# Altium schematic sheet Flasher_2Ch_Astable.SchDoc
size A
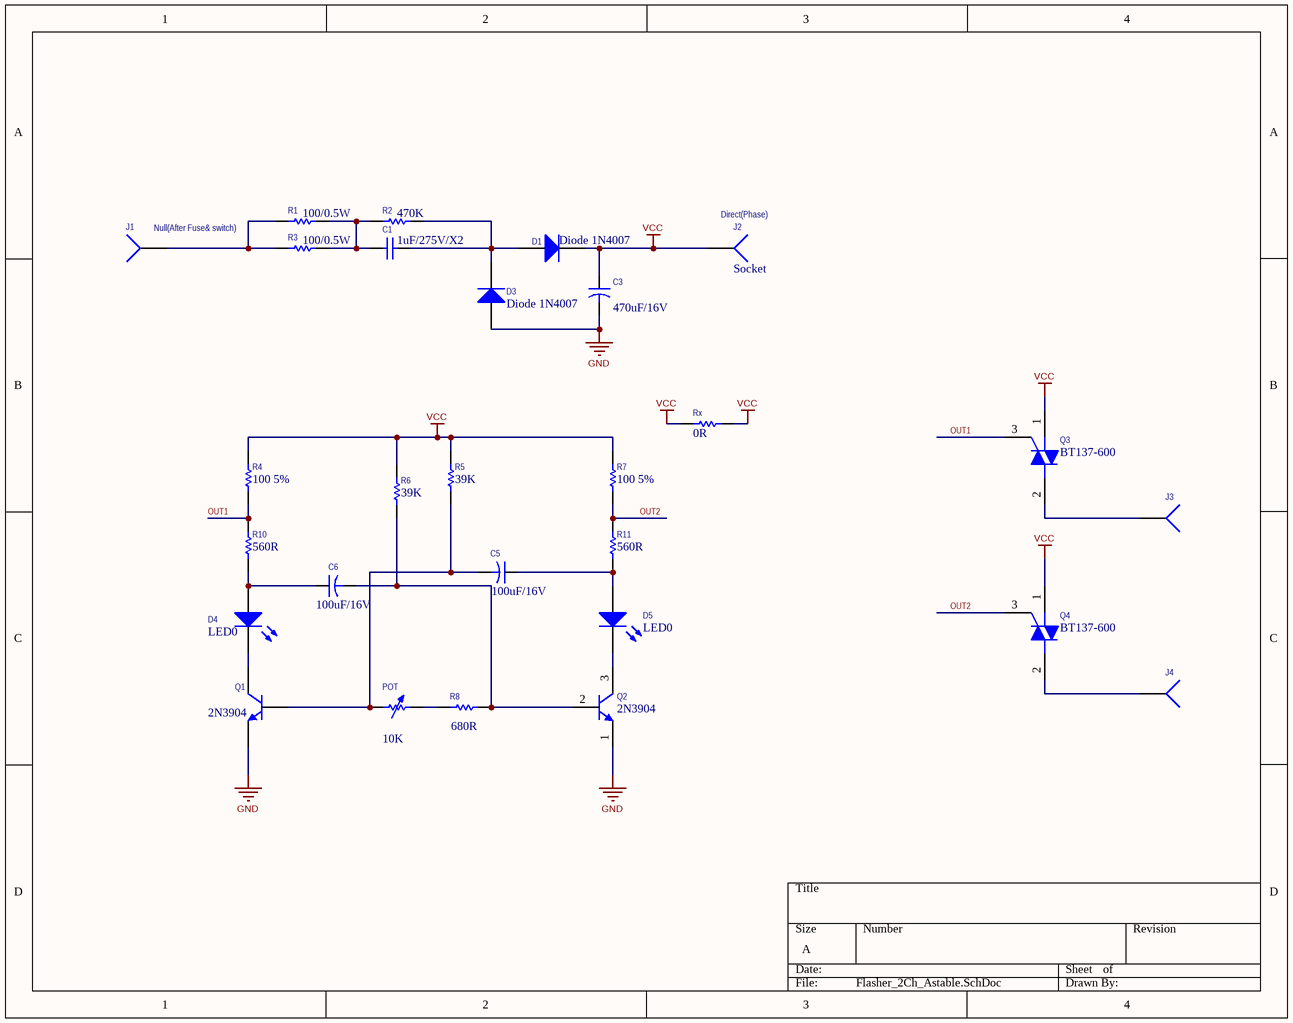
[diagram p0: Flasher_2Ch_Astable.SchDoc]

## Parts
C1  value 1uF/275V/X2  [Cap_polyester_275V_P22.5]  (hidden comment: Cap)
C3  value 470uF/16V  [Cap electrolitic radial 8x12-3.5]  (hidden comment: Cap2)
C5  value 100uF/16V  [Cap electrolitic radial 5x11-2]  (hidden comment: Cap2)
C6  value 100uF/16V  [Cap electrolitic radial 5x11-2]  (hidden comment: Cap2)
D1  Diode 1N4007  [DO-204AL]
D3  Diode 1N4007  [DO-204AL]
D4  LED0  [LED5MM_RED]
D5  LED0  [LED5MM_RED]
J1  Socket  [PIN1]  (value not drawn)
J2  Socket  [PIN1]
J3  Socket  [PIN1]  (value not drawn)
J4  Socket  [PIN1]  (value not drawn)
POT  value 10K  [AXIAL-0.4]  (hidden comment: Res Adj1)
Q1  2N3904  [TO-92 CF REV]
Q2  2N3904  [TO-92 CF]
Q3  BT137-600  [TO-220 AB with heatsink ya25]
Q4  BT137-600  [TO-220 AB with heatsink ya25]
R1  value 100/0.5W  [Axial 0_5W 5_0mm]  (hidden comment: Res1)
R2  value 470K  [Axial 0_25 W, 0_4 IN LEAD PITCH]  (hidden comment: Res1)
R3  value 100/0.5W  [Axial 0_5W 5_0mm]  (hidden comment: Res1)
R4  value 100 5%  [Axial 0_25 W, 0_4 IN LEAD PITCH]  (hidden comment: Res1)
R5  value 39K  [Axial 0_25 W, 0_4 IN LEAD PITCH]  (hidden comment: Res1)
R6  value 39K  [Axial 0_25 W, 0_4 IN LEAD PITCH]  (hidden comment: Res1)
R7  value 100 5%  [Axial 0_25 W, 0_4 IN LEAD PITCH]  (hidden comment: Res1)
R8  value 680R  [Axial 0_25 W, 0_4 IN LEAD PITCH]  (hidden comment: Res1)
R10  value 560R  [Axial 0_25 W, 0_4 IN LEAD PITCH]  (hidden comment: Res1)
R11  value 560R  [Axial 0_25 W, 0_4 IN LEAD PITCH]  (hidden comment: Res1)
Rx  value 0R  [axial-0.4]  (hidden comment: Res1)

## Nets
GND: C3.2 D3.1(A) Q1.1(E) Q2.1(E)
VCC: C3.1 D1.2(K) J2.1 Q3.1(M1) Q4.1(M1) R4.2 R5.2 R6.2 R7.2 Rx.1 Rx.2
OUT1: Q3.3(G) R4.1 R10.2
OUT2: Q4.3(G) R7.1 R11.2
NetC1_1: C1.1 R1.2 R2.1 R3.2
NetC1_2: C1.2 D1.1(A) D3.2(K) R2.2
NetC5_1: C5.1 D5.1(A) R11.1
NetC5_2: C5.2 POT.1 Q1.2(B) R5.1
NetC6_1: C6.1 D4.1(A) R10.1
NetC6_2: C6.2 Q2.2(B) R6.1 R8.1
NetD4_2: D4.2(K) Q1.3(C)
NetD5_2: D5.2(K) Q2.3(C)
NetJ1_1: J1.1 R1.1 R3.1
NetJ3_1: J3.1 Q3.2(M2)
NetJ4_1: J4.1 Q4.2(M2)
NetPOT_2: POT.2 R8.2

## Notes on the sheet
- Null(After Fuse& switch)
- (near J2) Direct(Phase)

## Library data of the parts
C1 = Cap: Capacitor; Published: 8-Jun-2000; LatestRevisionDate: 17-Jul-2002; LatestRevisionNote: Re-released for DXP Platform.; PackageReference: RAD-0.3; Publisher: Altium Limited; PackageDescription: Radial Cap, Thru-Hole; 2 Leads; 0.3 in Pin Spacing
C3 C5 C6 = Cap2: Capacitor; Published: 23-Sep-2002; PackageReference: CAPR5-4X5; Publisher: Altium Limited; PackageDescription: Capacitor; 2 Leads
D1 D3 = Diode 1N4007: 1 Amp General Purpose Rectifier; Published: 8-Jun-2000; LatestRevisionDate: 17-Jul-2002; LatestRevisionNote: Re-released for DXP Platform.; DatasheetVersion: 1998; PackageVersion: Aug-1999; PackageReference: DO-41; Publisher: Altium Limited; PackageDescription: Diode, Axial; Body 5.2 x 2.7 mm (LxDia. max), Lead Dia. 0.86 mm (max); Code_JEDEC: DO-204-AL; ComponentLink1Description: Manufacturer Link; ComponentLink1URL: http://www.fairchildsemi.com/; ComponentLink2Description: Datasheet; ComponentLink2URL: http://www.fairchildsemi.com/ds/1N%2F1N4001.pdf
D4 D5 = LED0: Typical INFRARED GaAs LED; Published: 8-Jun-2000; LatestRevisionDate: 08-Jul-2005; LatestRevisionNote: Mech Layer 1 removed.; PackageReference: LED-0; Publisher: Altium Limited; PackageDescription: LED; 2 Leads
POT = Res Adj1: Variable Resistor; Set Position: 0.5; Published: 8-Jun-2000; LatestRevisionDate: 17-Jul-2002; LatestRevisionNote: Re-released for DXP Platform.; PackageReference: AXIAL-0.7; Publisher: Altium Limited; PackageDescription: Axial Device, Thru-Hole; 2 Leads; 0.7 in Pin Spacing
Q1 Q2 = 2N3904: NPN General Purpose Amplifier; Published: 8-Jun-2000; LatestRevisionDate: 15-Jan-2003; LatestRevisionNote: PCB Footprint 'BCY-W3/D4.7' replaced; DatasheetVersion: 1997; PackageVersion: Sep-1998; PackageReference: TO-92A; Publisher: Altium Limited; PackageDescription: TO, Flat Index; 3 In-Line, Axial Leads; Body Dia. 4.5mm; Leads 0.51 x 0.48 mm (max); ComponentLink1Description: Manufacturer Link; ComponentLink1URL: http://www.fairchildsemi.com/; ComponentLink2Description: Datasheet; ComponentLink2URL: http://www.fairchildsemi.com/ds/2N%2F2N3904.pdf
Q3 Q4 = Triac: Silicon Bidirectional Triode Thyristor; Note: Pin 2 is electrically connected to Pin 4 (TAB); Published: 29-Sep-2000; LatestRevisionDate: 17-Jul-2002; LatestRevisionNote: Re-released for DXP Platform.; DatasheetVersion: 1999; PackageReference: 369-03; Publisher: Altium Limited; PackageDescription: TO, Thru-Hole, Vertical, Heatsink Mounted; 3 In-Line Leads; Pitch 2.28 mm; ComponentLink1Description: Manufacturer Link; ComponentLink1URL: http://www.motorola.com/
R1-R8 R10 R11 Rx = Res1: Resistor; Published: 8-Jun-2000; LatestRevisionDate: 17-Jul-2002; LatestRevisionNote: Re-released for DXP Platform.; PackageReference: AXIAL-0.3; Publisher: Altium Limited; PackageDescription: Axial Device, Thru-Hole; 2 Leads; 0.3 in Pin Spacing
J1-J4 = Socket: LatestRevisionDate: 17-Jul-2002; LatestRevisionNote: Re-released for DXP Platform.; Publisher: Altium Limited